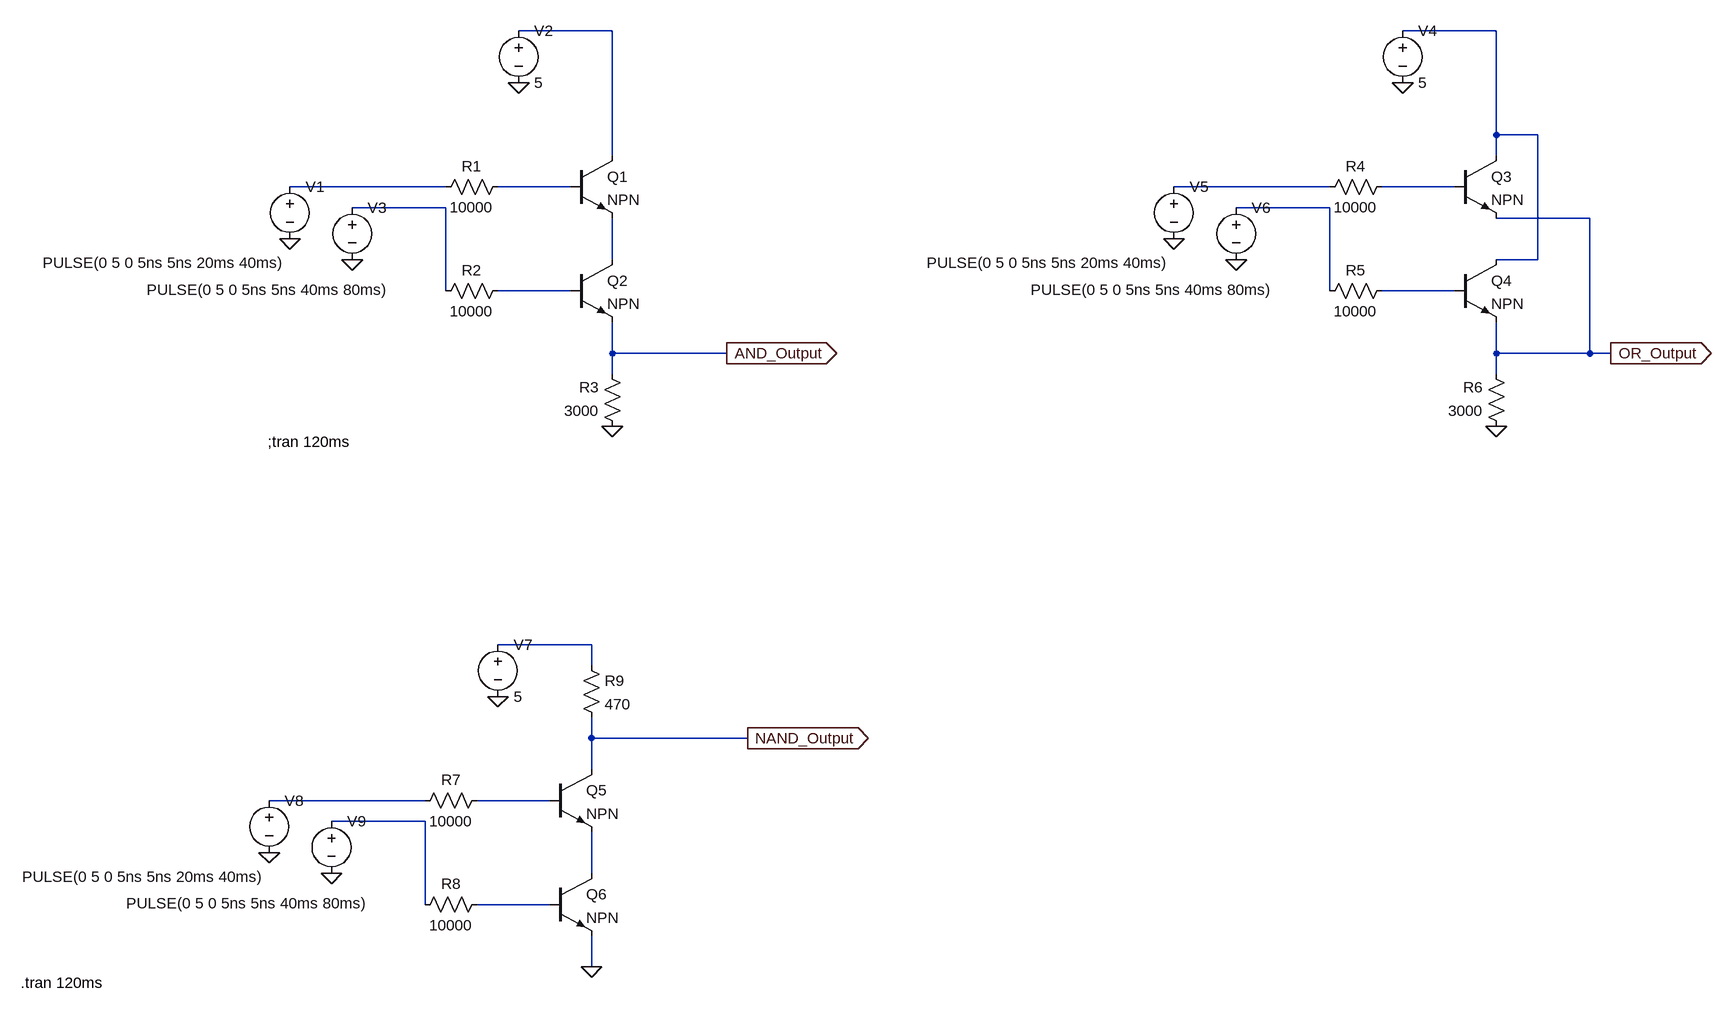
[diagram p0: schematic LogicGatesWithTransistors.asc]
LogicGatesWithTransistors.asc, the LTspice schematic file:
Version 4
SHEET 1 1916 1384
WIRE 176 -208 32 -208
WIRE 1536 -208 1392 -208
WIRE 1536 -48 1536 -208
WIRE 1600 -48 1536 -48
WIRE 176 -16 176 -208
WIRE 1536 -16 1536 -48
WIRE -80 32 -320 32
WIRE 112 32 0 32
WIRE 1280 32 1040 32
WIRE 1472 32 1360 32
WIRE -80 64 -224 64
WIRE 1280 64 1136 64
WIRE 1680 80 1536 80
WIRE 176 144 176 80
WIRE 1600 144 1600 -48
WIRE 1600 144 1536 144
WIRE -80 192 -80 64
WIRE 112 192 0 192
WIRE 1280 192 1280 64
WIRE 1472 192 1360 192
WIRE 176 288 176 240
WIRE 352 288 176 288
WIRE 1536 288 1536 240
WIRE 1680 288 1680 80
WIRE 1680 288 1536 288
WIRE 1712 288 1680 288
WIRE 176 320 176 288
WIRE 1536 320 1536 288
WIRE 144 736 0 736
WIRE 144 768 144 736
WIRE 144 880 144 848
WIRE 384 880 144 880
WIRE 144 928 144 880
WIRE -112 976 -352 976
WIRE 80 976 -32 976
WIRE -112 1008 -256 1008
WIRE 144 1088 144 1024
WIRE -112 1136 -112 1008
WIRE 80 1136 -32 1136
WIRE 144 1232 144 1184
FLAG 176 400 0
FLAG 32 -128 0
FLAG 352 288 AND_Output
IOPIN 352 288 Out
FLAG -224 144 0
FLAG -320 112 0
FLAG 1536 400 0
FLAG 1392 -128 0
FLAG 1712 288 OR_Output
IOPIN 1712 288 Out
FLAG 1136 144 0
FLAG 1040 112 0
FLAG 0 816 0
FLAG -256 1088 0
FLAG -352 1056 0
FLAG 144 1232 0
FLAG 384 880 NAND_Output
IOPIN 384 880 Out
SYMBOL npn 112 -16 R0
SYMATTR InstName Q1
SYMBOL npn 112 144 R0
SYMATTR InstName Q2
SYMBOL res 16 16 R90
WINDOW 0 0 56 VBottom 2
WINDOW 3 32 56 VTop 2
SYMATTR InstName R1
SYMATTR Value 10000
SYMBOL res 16 176 R90
WINDOW 0 0 56 VBottom 2
WINDOW 3 32 56 VTop 2
SYMATTR InstName R2
SYMATTR Value 10000
SYMBOL res 192 416 R180
WINDOW 0 36 76 Left 2
WINDOW 3 36 40 Left 2
SYMATTR InstName R3
SYMATTR Value 3000
SYMBOL voltage 32 -224 R0
WINDOW 123 0 0 Left 0
WINDOW 39 0 0 Left 0
SYMATTR InstName V2
SYMATTR Value 5
SYMBOL voltage -320 16 R0
WINDOW 3 -380 133 Left 2
WINDOW 123 0 0 Left 0
WINDOW 39 0 0 Left 0
SYMATTR InstName V1
SYMATTR Value PULSE(0 5 0 5ns 5ns 20ms 40ms)
SYMBOL voltage -224 48 R0
WINDOW 3 -316 142 Left 2
WINDOW 123 0 0 Left 0
WINDOW 39 0 0 Left 0
SYMATTR InstName V3
SYMATTR Value PULSE(0 5 0 5ns 5ns 40ms 80ms)
SYMBOL npn 1472 -16 R0
SYMATTR InstName Q3
SYMBOL npn 1472 144 R0
SYMATTR InstName Q4
SYMBOL res 1376 16 R90
WINDOW 0 0 56 VBottom 2
WINDOW 3 32 56 VTop 2
SYMATTR InstName R4
SYMATTR Value 10000
SYMBOL res 1376 176 R90
WINDOW 0 0 56 VBottom 2
WINDOW 3 32 56 VTop 2
SYMATTR InstName R5
SYMATTR Value 10000
SYMBOL res 1552 416 R180
WINDOW 0 36 76 Left 2
WINDOW 3 36 40 Left 2
SYMATTR InstName R6
SYMATTR Value 3000
SYMBOL voltage 1392 -224 R0
WINDOW 123 0 0 Left 0
WINDOW 39 0 0 Left 0
SYMATTR InstName V4
SYMATTR Value 5
SYMBOL voltage 1040 16 R0
WINDOW 3 -380 133 Left 2
WINDOW 123 0 0 Left 0
WINDOW 39 0 0 Left 0
SYMATTR InstName V5
SYMATTR Value PULSE(0 5 0 5ns 5ns 20ms 40ms)
SYMBOL voltage 1136 48 R0
WINDOW 3 -316 142 Left 2
WINDOW 123 0 0 Left 0
WINDOW 39 0 0 Left 0
SYMATTR InstName V6
SYMATTR Value PULSE(0 5 0 5ns 5ns 40ms 80ms)
SYMBOL npn 80 928 R0
SYMATTR InstName Q5
SYMBOL npn 80 1088 R0
SYMATTR InstName Q6
SYMBOL res -16 960 R90
WINDOW 0 0 56 VBottom 2
WINDOW 3 32 56 VTop 2
SYMATTR InstName R7
SYMATTR Value 10000
SYMBOL res -16 1120 R90
WINDOW 0 0 56 VBottom 2
WINDOW 3 32 56 VTop 2
SYMATTR InstName R8
SYMATTR Value 10000
SYMBOL voltage 0 720 R0
WINDOW 123 0 0 Left 0
WINDOW 39 0 0 Left 0
SYMATTR InstName V7
SYMATTR Value 5
SYMBOL voltage -352 960 R0
WINDOW 3 -380 133 Left 2
WINDOW 123 0 0 Left 0
WINDOW 39 0 0 Left 0
SYMATTR InstName V8
SYMATTR Value PULSE(0 5 0 5ns 5ns 20ms 40ms)
SYMBOL voltage -256 992 R0
WINDOW 3 -316 142 Left 2
WINDOW 123 0 0 Left 0
WINDOW 39 0 0 Left 0
SYMATTR InstName V9
SYMATTR Value PULSE(0 5 0 5ns 5ns 40ms 80ms)
SYMBOL res 128 752 R0
SYMATTR InstName R9
SYMATTR Value 470
TEXT -354 424 Left 2 !;tran 120ms
TEXT -734 1256 Left 2 !.tran 120ms

The netlist it stands for:
* LogicGatesWithTransistors.asc
Q1 N001 N004 N009 0 NPN
Q2 N009 N010 AND_Output 0 NPN
R1 N004 N003 10000
R2 N010 N007 10000
R3 0 AND_Output 3000
V2 N001 0 5
V1 N003 0 PULSE(0 5 0 5ns 5ns 20ms 40ms)
V3 N007 0 PULSE(0 5 0 5ns 5ns 40ms 80ms)
Q3 N002 N006 OR_Output 0 NPN
Q4 N002 N011 OR_Output 0 NPN
R4 N006 N005 10000
R5 N011 N008 10000
R6 0 OR_Output 3000
V4 N002 0 5
V5 N005 0 PULSE(0 5 0 5ns 5ns 20ms 40ms)
V6 N008 0 PULSE(0 5 0 5ns 5ns 40ms 80ms)
Q5 NAND_Output N014 N016 0 NPN
Q6 N016 N017 0 0 NPN
R7 N014 N013 10000
R8 N017 N015 10000
V7 N012 0 5
V8 N013 0 PULSE(0 5 0 5ns 5ns 20ms 40ms)
V9 N015 0 PULSE(0 5 0 5ns 5ns 40ms 80ms)
R9 N012 NAND_Output 470
.model NPN NPN
.model PNP PNP
.lib standard.bjt
;tran 120ms
.tran 120ms
.backanno
.end